# Altium project simple-dash-q23.PrjPcb
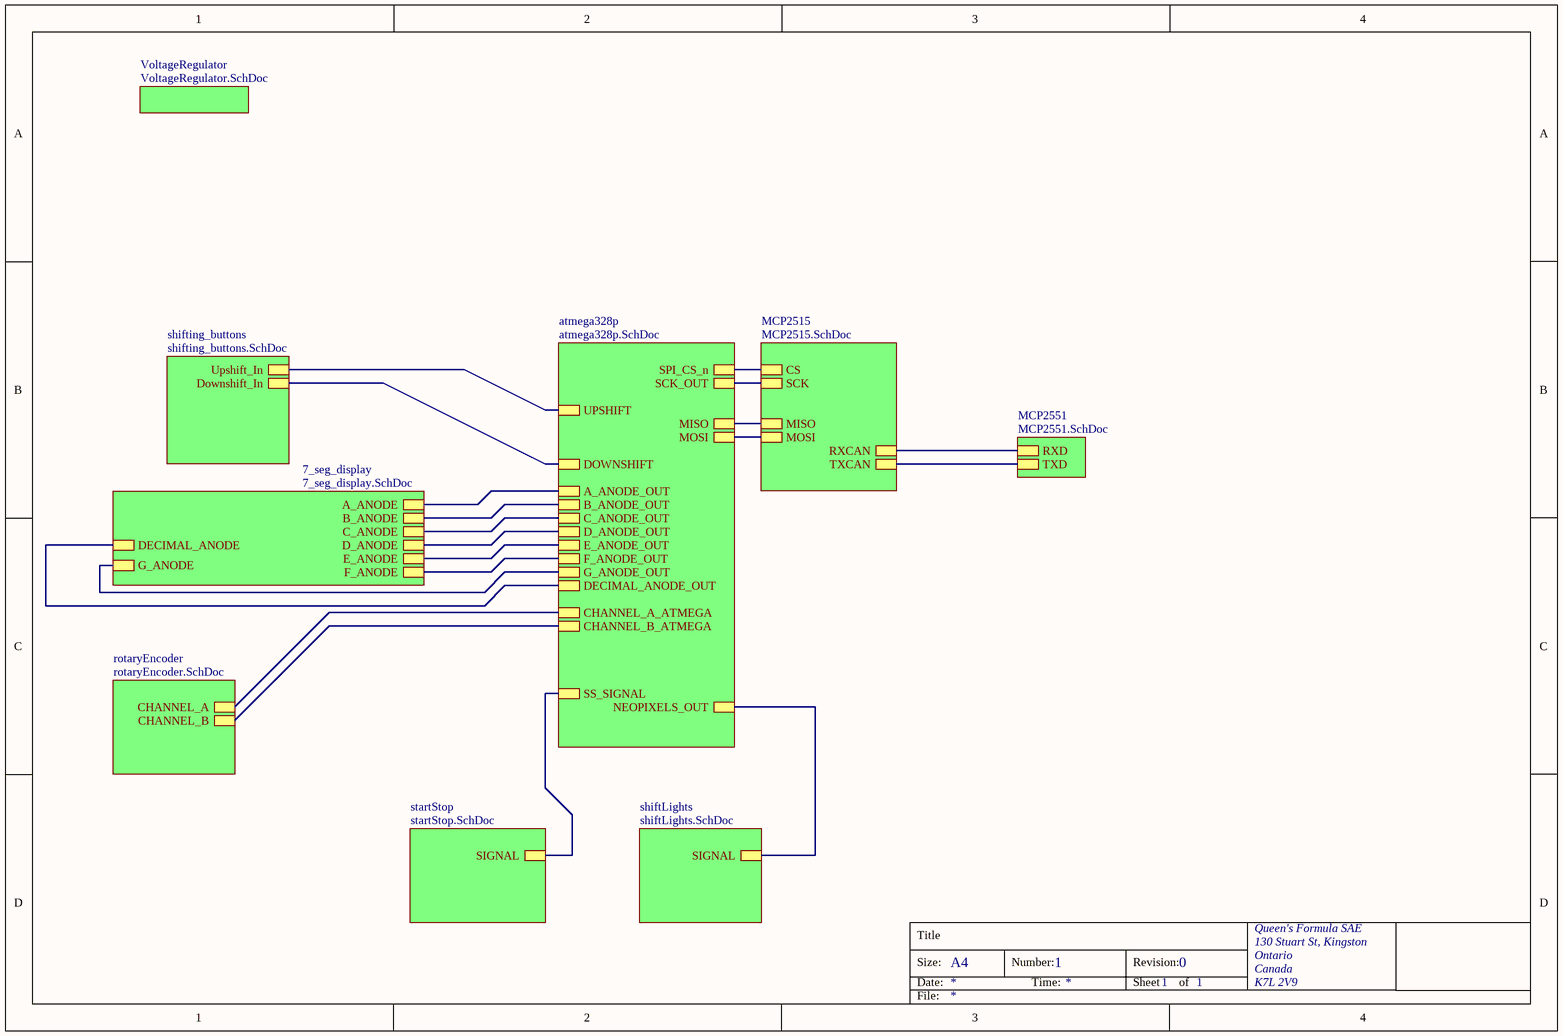
[diagram p0: TOP.SchDoc]
10 sheets, 60 parts. Net scope: hierarchical (ports join the sheet entries above them; power ports are global).
Board files: PCB.PcbDoc, VoltageRegulator.PcbDoc
Sheets:
  TOP.SchDoc
    VoltageRegulator = VoltageRegulator.SchDoc
    atmega328p = atmega328p.SchDoc
    MCP2515 = MCP2515.SchDoc
    MCP2551 = MCP2551.SchDoc
    shifting_buttons = shifting_buttons.SchDoc
    7_seg_display = 7_seg_display.SchDoc
    rotaryEncoder = rotaryEncoder.SchDoc
    startStop = startStop.SchDoc
    shiftLights = shiftLights.SchDoc

## Sheet TOP.SchDoc: =DocumentName
size A4; Organization: Queen's Formula SAE; Address1: 130 Stuart St, Kingston; Address2: Ontario; Address3: Canada; Address4: K7L 2V9; DocumentNumber: 1; Revision: 0; SheetNumber: 1; SheetTotal: 1

### Sub-sheets
7_seg_display = 7_seg_display.SchDoc: A_ANODE, B_ANODE, C_ANODE, D_ANODE, E_ANODE, F_ANODE, G_ANODE, DECIMAL_ANODE
atmega328p = atmega328p.SchDoc: SPI_CS_n, UPSHIFT, MOSI, MISO, SCK_OUT, DOWNSHIFT, CHANNEL_A_ATMEGA, CHANNEL_B_ATMEGA, NEOPIXELS_OUT, A_ANODE_OUT, B_ANODE_OUT, C_ANODE_OUT, D_ANODE_OUT, E_ANODE_OUT, F_ANODE_OUT, G_ANODE_OUT, DECIMAL_ANODE_OUT, SS_SIGNAL
MCP2515 = MCP2515.SchDoc: MOSI, MISO, CS, SCK, TXCAN, RXCAN
MCP2551 = MCP2551.SchDoc: RXD, TXD
rotaryEncoder = rotaryEncoder.SchDoc: CHANNEL_A, CHANNEL_B
shifting_buttons = shifting_buttons.SchDoc: Upshift_In, Downshift_In
shiftLights = shiftLights.SchDoc: SIGNAL
startStop = startStop.SchDoc: SIGNAL
VoltageRegulator = VoltageRegulator.SchDoc: no entries

### Nets
A_ANODE_OUT: sheet atmega328p/A_ANODE_OUT, sheet 7_seg_display/A_ANODE
B_ANODE_OUT: sheet atmega328p/B_ANODE_OUT, sheet 7_seg_display/B_ANODE
C_ANODE_OUT: sheet atmega328p/C_ANODE_OUT, sheet 7_seg_display/C_ANODE
D_ANODE_OUT: sheet atmega328p/D_ANODE_OUT, sheet 7_seg_display/D_ANODE
DA_OUT: sheet atmega328p/DECIMAL_ANODE_OUT, sheet 7_seg_display/DECIMAL_ANODE
DOWNSHIFT: sheet atmega328p/DOWNSHIFT, sheet shifting_buttons/Downshift_In
E_ANODE_OUT: sheet atmega328p/E_ANODE_OUT, sheet 7_seg_display/E_ANODE
F_ANODE_OUT: sheet atmega328p/F_ANODE_OUT, sheet 7_seg_display/F_ANODE
G_ANODE_OUT: sheet atmega328p/G_ANODE_OUT, sheet 7_seg_display/G_ANODE
MISO: sheet atmega328p/MOSI, sheet atmega328p/MISO, sheet atmega328p/SCK_OUT, sheet MCP2515/MOSI, sheet MCP2515/MISO, sheet MCP2515/SCK
NEOPIXELS_OUT: sheet atmega328p/NEOPIXELS_OUT, sheet shiftLights/SIGNAL
SPI_CS_n: sheet atmega328p/SPI_CS_n, sheet MCP2515/CS
UPSHIFT: sheet atmega328p/UPSHIFT, sheet shifting_buttons/Upshift_In
NetENC1_A: sheet atmega328p/CHANNEL_A_ATMEGA, sheet rotaryEncoder/CHANNEL_A
NetENC1_B: sheet atmega328p/CHANNEL_B_ATMEGA, sheet rotaryEncoder/CHANNEL_B
NetP12_1: sheet atmega328p/SS_SIGNAL, sheet startStop/SIGNAL
NetU3_1: sheet MCP2515/TXCAN, sheet MCP2551/TXD
NetU3_2: sheet MCP2515/RXCAN, sheet MCP2551/RXD

### Notes on the sheet
- Title
- Size:
- Date:
- A4
- Number:
- Time:
- Revision:
- Sheet
- of
- File:

## Sheet VoltageRegulator.SchDoc
size A4; SPICEModelCacheXNGDLXAO: <root> / <DocumentId>XNGDLXAO</DocumentId> / <CacheFrame Number="0"> / <Model Name="led1" Kind="MDL"> / <Text>*Typ RED GaAs LED: Vf=1.7V Vr=4V If=40mA trr=3uS / *LED Pinout: 1=A, 2=K / .MODEL LED1 D (IS=93.2P RS=42M N=3.73 BV=4 IBV=10U / + CJO=2.97P VJ=.75 M=.333 TT=4.32U)</Text> / </Model> / </CacheFrame> / </root>
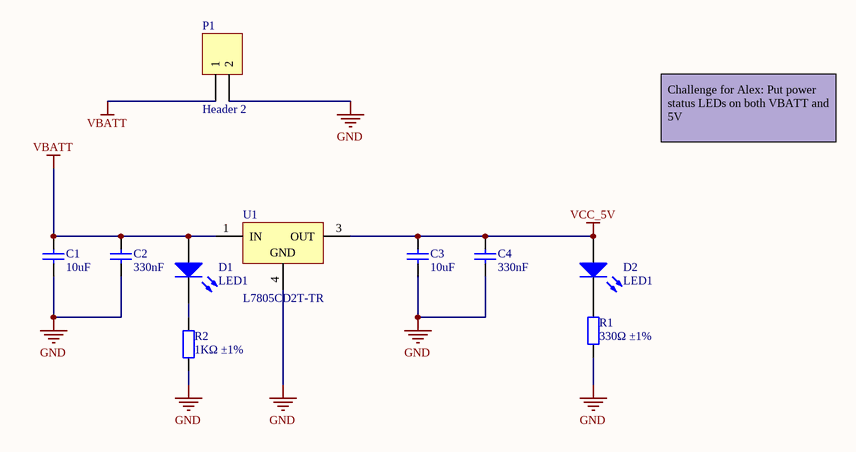
[diagram p1: VoltageRegulator.SchDoc]

### Parts
C1  10uF  [1206_C]
C2  330nF  [0603_C]
C3  10uF  [1206_C]
C4  330nF  [0603_C]
D1  LED1  [LED-1]
D2  LED1  [LED-1]
P1  Header 2  [HDR1X2]
R1  330Ω ±1%  [0603_R]
R2  1KΩ ±1%  [0805_R]
U1  L7805CD2T-TR  [TO-263_M]

### Nets
GND: C1.1 C2.1 C3.1 C4.1 P1.2 R1.2 R2.1 U1.4(GND)
VBATT: C1.2 C2.2 D1.1(A) P1.1 U1.1(IN)
VCC_5V: C3.2 C4.2 D2.1(A) U1.3(OUT)
NetD1_2: D1.2(K) R2.2
NetD2_2: D2.2(K) R1.1

### Notes on the sheet
- Challenge for Alex: Put power status LEDs on both VBATT and 5V

### Library data of the parts
C1 C3 = 1206 10uF (106) 10% 50V: Chip capacitors; Manufacturer: Samsung Electro-Mechanics; PartNumber: CL31A106KBHNNNE; Tolerance: 10%; Voltage: 50V; ComponentLink1Description: Supplier link; ComponentLink1URL: http://www.szlcsc.com/product/details_14236.html; Package: 1206; Supplier: LC; SuppliersPartNumber: C13585; Capacitance: 10uF
C2 C4 = 0603 330nF (334) 10% 25V: Chip capacitors; Manufacturer: Guangdong Fenghua Advanced Tech; PartNumber: 0603B334K250NT; Tolerance: 10%; Voltage: 25V; ComponentLink1Description: Supplier link; ComponentLink1URL: http://www.szlcsc.com/product/details_1967.html; Package: 0603; Supplier: LC; SuppliersPartNumber: C1615; Capacitance: 330nF
D1 D2 = LED1: Typical RED GaAs LED; Published: 8-Jun-2000; LatestRevisionDate: 08-Jul-2005; LatestRevisionNote: Mech Layer 1 removed.; PackageReference: LED-1; Publisher: Altium Limited; PackageDescription: LED; 2 Leads
P1 = Header 2: Header, 2-Pin; LatestRevisionDate: 17-Jul-2002; LatestRevisionNote: Re-released for DXP Platform.; Publisher: Altium Limited
R1 = 0603 330R (3300) 1%: Chip resistor; Manufacturer: Uniroyal Elec; PartNumber: 0603WAF3300T5E; Power: 1/10W; ComponentLink1Description: Supplier link; ComponentLink1URL: http://www.szlcsc.com/product/details_23865.html; Package: 0603; Supplier: LC; SuppliersPartNumber: C23138; Resistance: 330Ω; Tolerance: 1%
R2 = 0805 1K (1001) 1%: Chip resistor; Manufacturer: Uniroyal Elec; Power: 1/8W; ComponentLink1Description: Supplier link; ComponentLink1URL: http://www.szlcsc.com/product/details_18201.html; Package: 0805; Supplier: LC; SuppliersPartNumber: C17513; Tolerance: 1%
U1 = CMP-0244-00213-1: Positive Voltage Regulator, 3-Pin D2PAK, Tape and Reel; PackageReference: TO-263; ComponentLink2URL: http://www.st.com/internet/com/TECHNICAL_RESOURCES/TECHNICAL_LITERATURE/DATASHEET/CD00000444.pdf; PackageDescription: 3-Pin Transistor Outline Package 2.54 mm Pitch, 15.4 mm Lead Span (D2PAK); DatasheetVersion: 16/11/2011; ComponentLink2Description: Datasheet; ComponentLink1Description: Manufacturer URL; PackageVersion: 2011; ComponentLink1URL: http://www.st.com

## Sheet atmega328p.SchDoc
size A4
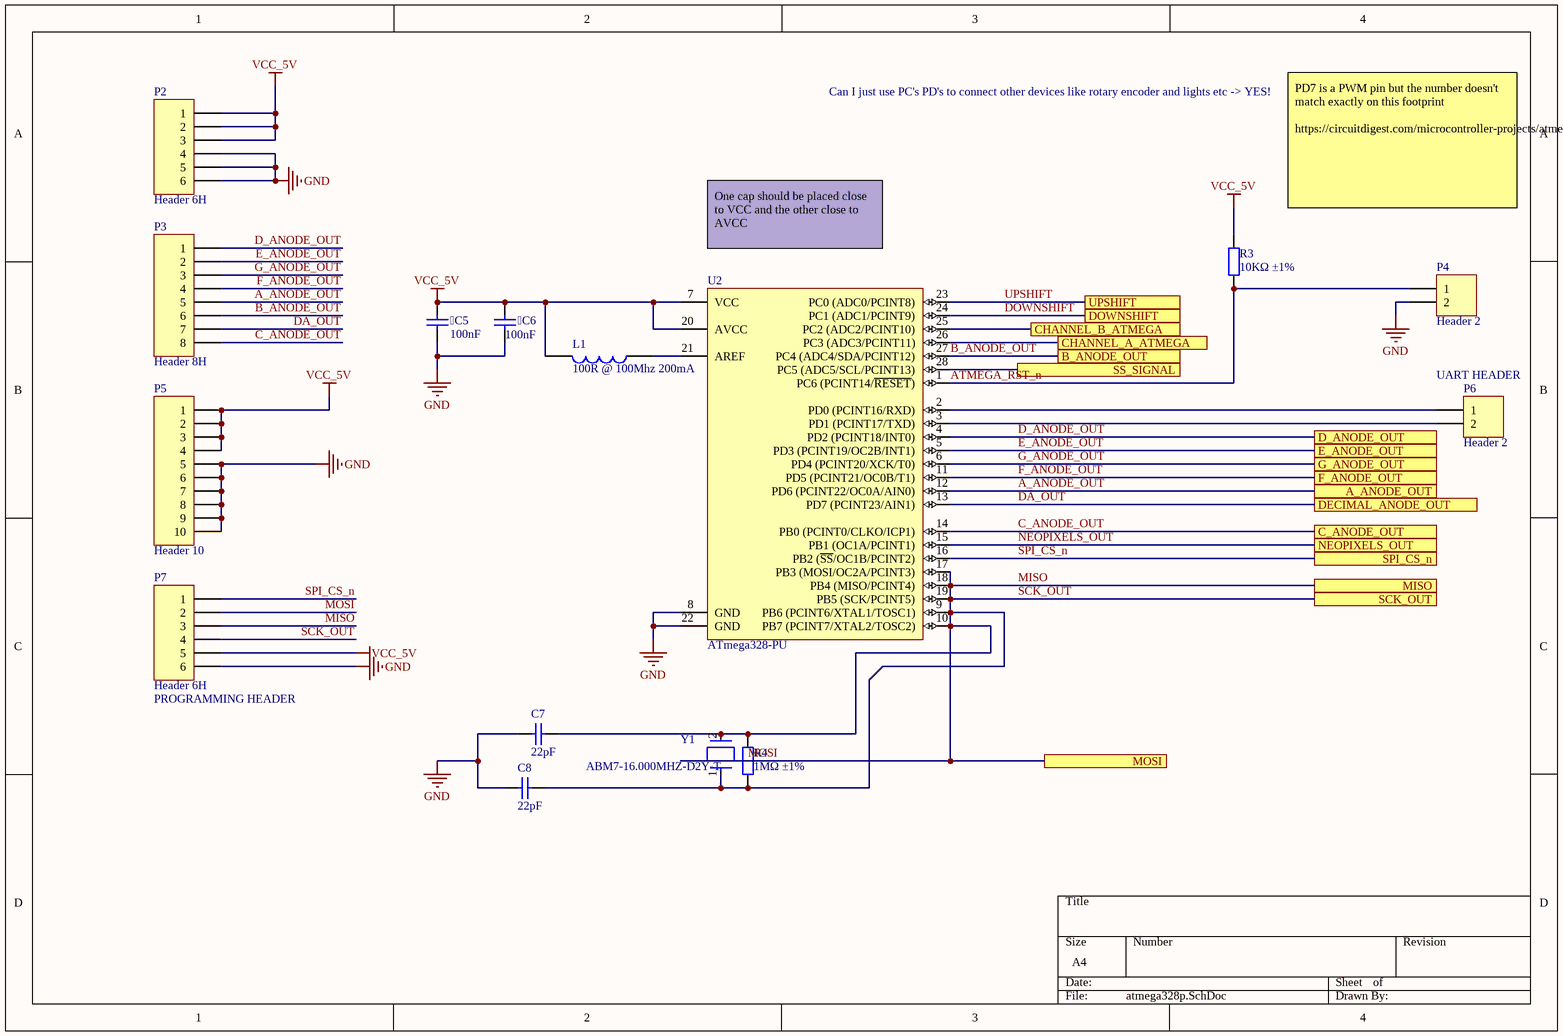
[diagram p2: atmega328p.SchDoc]

### Parts
C5  100nF  [0603_C]
C6  100nF  [0603_C]
C7  22pF  [0603_C]
C8  22pF  [0603_C]
L1  100R @ 100Mhz 200mA  [0603_L]
P2  Header 6H  [HDR1X6H]
P3  Header 8H  [HDR1X8H]
P4  Header 2  [HDR1X2]
P5  Header 10  [HDR1X10]
P6  Header 2  [HDR1X2]
P7  Header 6H  [HDR1X6H]
R3  10KΩ ±1%  [0603_R]
R4  1MΩ ±1%  [0603_R]
U2  ATmega328-PU  [28P3]
Y1  ABM7-16.000MHZ-D2Y-T  [FP-ABM7-MFG]

### Ports
A_ANODE_OUT, B_ANODE_OUT, C_ANODE_OUT, CHANNEL_A_ATMEGA, CHANNEL_B_ATMEGA, D_ANODE_OUT, DECIMAL_ANODE_OUT, DOWNSHIFT, E_ANODE_OUT, F_ANODE_OUT, G_ANODE_OUT, MISO, MOSI, NEOPIXELS_OUT, SCK_OUT, SPI_CS_n, SS_SIGNAL, UPSHIFT

### Nets
GND: C5.1 C6.1 C7.1 C8.1 P2.4 P2.5 P2.6 P4.2 P5.5 P5.6 P5.7 P5.8 P5.9 P5.10 P7.6 U2.8(GND) U2.22(GND)
VCC_5V: C5.2 C6.2 L1.2 P2.1 P2.2 P2.3 P5.1 P5.2 P5.3 P5.4 P7.5 R3.2 U2.7(VCC) U2.20(AVCC)
A_ANODE_OUT: P3.5 U2.12(PD6_(PCINT22/OC0A/AIN0)) ; port A_ANODE_OUT
ATMEGA_RST_n: P4.1 R3.1 U2.1(PC6_(PCINT14/~{RESET}))
B_ANODE_OUT: P3.6 U2.27(PC4_(ADC4/SDA/PCINT12)) ; port B_ANODE_OUT
C_ANODE_OUT: P3.8 U2.14(PB0_(PCINT0/CLKO/ICP1)) ; port C_ANODE_OUT
D_ANODE_OUT: P3.1 U2.4(PD2_(PCINT18/INT0)) ; port D_ANODE_OUT
DA_OUT: P3.7 U2.13(PD7_(PCINT23/AIN1)) ; port DECIMAL_ANODE_OUT
DOWNSHIFT: U2.24(PC1_(ADC1/PCINT9)) ; port DOWNSHIFT
E_ANODE_OUT: P3.2 U2.5(PD3_(PCINT19/OC2B/INT1)) ; port E_ANODE_OUT
F_ANODE_OUT: P3.4 U2.11(PD5_(PCINT21/OC0B/T1)) ; port F_ANODE_OUT
G_ANODE_OUT: P3.3 U2.6(PD4_(PCINT20/XCK/T0)) ; port G_ANODE_OUT
MISO: C7.2 C8.2 P7.2 P7.3 P7.4 R4.1 R4.2 U2.9(PB6_(PCINT6/XTAL1/TOSC1)) U2.10(PB7_(PCINT7/XTAL2/TOSC2)) U2.17(PB3_(MOSI/OC2A/PCINT3)) U2.18(PB4_(MISO/PCINT4)) U2.19(PB5_(SCK/PCINT5)) Y1.1 Y1.2 ; port MISO, port MOSI, port SCK_OUT  [also labelled MOSI, SCK_OUT]
NEOPIXELS_OUT: U2.15(PB1_(OC1A/PCINT1)) ; port NEOPIXELS_OUT
SPI_CS_n: P7.1 U2.16(PB2_(~{SS}/OC1B/PCINT2)) ; port SPI_CS_n
UPSHIFT: U2.23(PC0_(ADC0/PCINT8)) ; port UPSHIFT
NetENC1_A: U2.26(PC3_(ADC3/PCINT11)) ; port CHANNEL_A_ATMEGA
NetENC1_B: U2.25(PC2_(ADC2/PCINT10)) ; port CHANNEL_B_ATMEGA
NetL1_1: L1.1 U2.21(AREF)
NetP6_1: P6.1 U2.2(PD0_(PCINT16/RXD))
NetP6_2: P6.2 U2.3(PD1_(PCINT17/TXD))
NetP12_1: U2.28(PC5_(ADC5/SCL/PCINT13)) ; port SS_SIGNAL

### Notes on the sheet
- Can I just use PC's PD's to connect other devices like rotary encoder and lights etc -> YES!
- One cap should be placed close to VCC and the other close to AVCC
- PD7 is a PWM pin but the number doesn't match exactly on this footprint
  https://circuitdigest.com/microcontroller-projects/atmega16-32-microcontroller-pwm-tutorial-to-control-brightness-of-led
- (near P6) UART HEADER
- (near P7) PROGRAMMING HEADER

### Library data of the parts
C5 C6 = 0603 100nF (104) 10% 50V: Chip capacitors; Manufacturer: YAGEO; PartNumber: CC0603KRX7R9BB104; Tolerance: 10%; Voltage: 50V; ComponentLink1Description: Supplier link; ComponentLink1URL: http://www.szlcsc.com/product/details_15331.html; Package: 0603; Supplier: LC; SuppliersPartNumber: C14663; Capacitance: 100nF
C7 C8 = 0603 22pF (220) 5% 50V: Chip capacitors; Manufacturer: Samsung Electro-Mechanics; PartNumber: CL10C220JB8NNNC; Tolerance: 5%; Voltage: 50V; ComponentLink1Description: Supplier link; ComponentLink1URL: http://www.szlcsc.com/product/details_2005.html; Package: 0603; Supplier: LC; SuppliersPartNumber: C1653; Capacitance: 22pF
L1 = 0603 100R@100Mhz 0.2A: Ferrite Bead; Notepad: *; Package: 0603; Supplier: LC; SuppliersPartNumber: C98498
P2 P7 = Header 6H: Header, 6-Pin, Right Angle; LatestRevisionDate: 17-Jul-2002; LatestRevisionNote: Re-released for DXP Platform.; Publisher: Altium Limited
P3 = Header 8H: Header, 8-Pin, Right Angle; LatestRevisionDate: 17-Jul-2002; LatestRevisionNote: Re-released for DXP Platform.; Publisher: Altium Limited
P4 P6 = Header 2: Header, 2-Pin; LatestRevisionDate: 17-Jul-2002; LatestRevisionNote: Re-released for DXP Platform.; Publisher: Altium Limited
P5 = Header 10: Header, 10-Pin; LatestRevisionDate: 17-Jul-2002; LatestRevisionNote: Re-released for DXP Platform.; Publisher: Altium Limited
R3 = 0603 10K (1002) 1%: Chip resistor; Manufacturer: Uniroyal Elec; PartNumber: 0603WAF1002T5E; Power: 1/10W; ComponentLink1Description: Supplier link; ComponentLink1URL: http://www.szlcsc.com/product/details_26547.html; Package: 0603; Supplier: LC; SuppliersPartNumber: C25804; Resistance: 10KΩ; Tolerance: 1%
R4 = 0603 1M (1004) 1%: Chip resistor; Manufacturer: Uniroyal Elec; PartNumber: 0603WAF1004T5E; Power: 1/10W; ComponentLink1Description: Supplier link; ComponentLink1URL: http://www.szlcsc.com/product/details_23662.html; Package: 0603; Supplier: LC; SuppliersPartNumber: C22935; Resistance: 1MΩ; Tolerance: 1%
U2 = CMP-0095-00015-2: 8-bit AVR Microcontroller, 32KB Flash, 1KB EEPROM, 2KB SRAM, 28-pin PDIP, Industrial Grade (-40°C to 85°C); ComponentLink3Description: ATmega48A/48PA/88A/88PA/168A/168PA/328/328P Summary; RevisionNote: DatasheetVersion updated. URLs added.; DatasheetVersion: revD, May-2011; ComponentLink1URL: http://www.atmel.com/; PackageVersion: revB, Sep-2001; PackageDescription: 28-lead (0.300"/7.62mm Wide) Plastic Dual Inline Package (PDIP); PackageReference: 28P3; ComponentLink1Description: Manufacturer URL; ComponentLink2Description: ATmega48A/48PA/88A/88PA/168A/168PA/328/328P Datasheet; ComponentLink3URL: http://www.atmel.com/dyn/resources/prod_documents/8271S.pdf; ComponentLink2URL: http://www.atmel.com/dyn/resources/prod_documents/8271.pdf
Y1 = CMP-27762-000095-1: Crystal 16MHz ±20ppm 18pF SMD-2 6mm x 3.5mm; ESR (Equivalent Series Resistance): 50R; Frequency Stability: 30ppm; Width: 3.3mm; Frequency: 16MHz; Radiation Hardening: No; Height: 0.055inch; Tolerance: 20ppm; Length: 6mm; Case/Package: CSMD; Lead Free: Lead Free; Min Operating Temperature: -40°C; Termination: SMD/SMT; Operating Frequency: 16 MHz; Resistor Type: Ceramic; Packaging: Tape and Reel; Mount: Surface Mount; Load Capacitance: 18pF; Frequency Tolerance: 20ppm; Depth: 3.5mm; Series: ABM7; Package Quantity: 1000; Max Operating Temperature: 85°C; Number of Pins: 2

## Sheet MCP2515.SchDoc
size A4
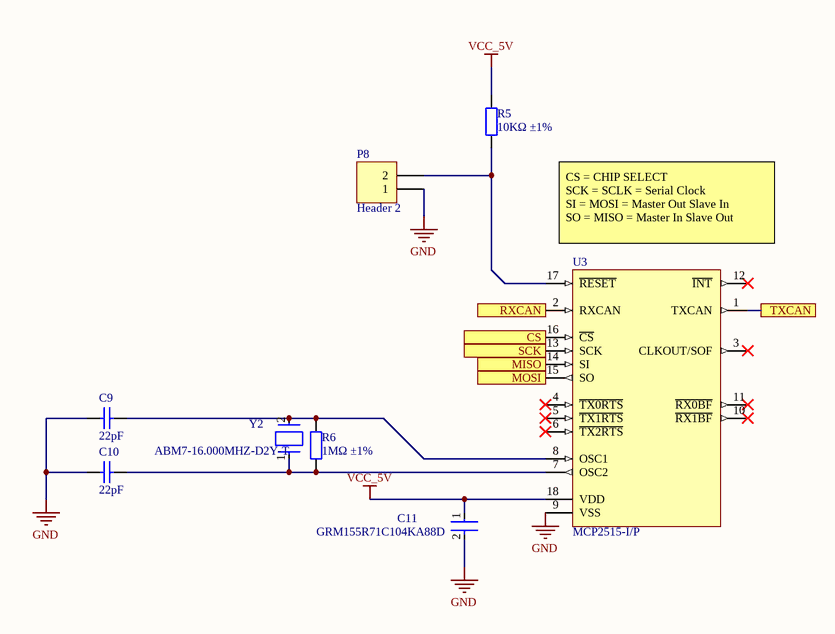
[diagram p3: MCP2515.SchDoc]

### Parts
C9  22pF  [0603_C]
C10  22pF  [0603_C]
C11  GRM155R71C104KA88D  [FP-GRM15-MFG]
P8  Header 2  [HDR1X2]
R5  10KΩ ±1%  [0603_R]
R6  1MΩ ±1%  [0603_R]
U3  MCP2515-I/P  [PDIP300-P18]
Y2  ABM7-16.000MHZ-D2Y-T  [FP-ABM7-MFG]

### Ports
CS, MISO, MOSI, RXCAN, SCK, TXCAN

### Nets
GND: C9.1 C10.1 C11.2 P8.1 U3.9(VSS)
VCC_5V: C11.1 R5.2 U3.18(VDD)
MISO: U3.13(SCK) U3.14(SI) U3.15(SO) ; port SCK, port MISO, port MOSI
SPI_CS_n: U3.16(~{CS}) ; port CS
NetC9_2: C9.2 R6.2 U3.8(OSC1) Y2.2
NetC10_2: C10.2 R6.1 U3.7(OSC2) Y2.1
NetP8_2: P8.2 R5.1 U3.17(~{RESET})
NetU3_1: U3.1(TXCAN) ; port TXCAN
NetU3_2: U3.2(RXCAN) ; port RXCAN

Not connected (* = marked no-connect by the designer): U3 3(CLKOUT/SOF)* 4(~{TX0RTS})* 5(~{TX1RTS})* 6(~{TX2RTS})* 10(~{RX1BF})* 11(~{RX0BF})* 12(~{INT})*

### Notes on the sheet
- (near U3) CS = CHIP SELECT
  SCK = SCLK = Serial Clock
  SI = MOSI = Master Out Slave In
  SO = MISO = Master In Slave Out

### Library data of the parts
C9 C10 = 0603 22pF (220) 5% 50V: as C7 on sheet atmega328p; ComponentLink1Description: Supplier link; ComponentLink1URL: http://www.szlcsc.com/product/details_2005.html; Package: 0603; Supplier: LC; SuppliersPartNumber: C1653; Capacitance: 22pF
C11 = CMP-2100-03641-2: CAP CER 0.1UF 16V X7R 0402; Manufacturer: Murata; Standoff Height: 0mm; Tolerance: 10%; Voltage Rating: 16Vdc; Material: Ceramic; Capacitance: 0.10μF; Value: 0.10μF; RoHS: TRUE; Manufacturer Part Number: GRM155R71C104KA88D; Temperature Characteristic: X7R; Octopart: https://octopart.com/grm155r71c104ka88d-murata-196880; Digikey Description: CAP CER 0.1UF 16V X7R 0402; Device Class L3: Ceramic Capacitors; Height: 0.55mm; ComponentLink2Description: Datasheet; Temperature Range Low: -55°C; Ipc Land Pattern Name: CAPC10050X219; ComponentLink2URL: https://search.murata.co.jp/Ceramy/image/img/A01X/G101/ENG/GRM155R71H471KA01-01A.pdf; Device Class L1: Passive Components; Lead Free: yes; Category: Cap; Package: GRM15; Temperature: -55°C to +125°C; Device Class L2: Capacitors; Temperature Range High: +125°C; Mouser Description: 0402 0.1 uF 16V ±10 % Tolerance X7R SMT Multilayer Ceramic Capacitor
P8 = Header 2: Header, 2-Pin; LatestRevisionDate: 17-Jul-2002; LatestRevisionNote: Re-released for DXP Platform.; Publisher: Altium Limited
R5 = 0603 10K (1002) 1%: as R3 on sheet atmega328p; ComponentLink1Description: Supplier link; ComponentLink1URL: http://www.szlcsc.com/product/details_26547.html; Package: 0603; Supplier: LC; SuppliersPartNumber: C25804; Resistance: 10KΩ; Tolerance: 1%
R6 = 0603 1M (1004) 1%: as R4 on sheet atmega328p; ComponentLink1Description: Supplier link; ComponentLink1URL: http://www.szlcsc.com/product/details_23662.html; Package: 0603; Supplier: LC; SuppliersPartNumber: C22935; Resistance: 1MΩ; Tolerance: 1%
U3 = CMP-0186-00010-2: Stand-Alone CAN Controller With SPI Interface, 18-Pin PDIP, Industrial Temperature; PackageReference: PDIP300-P18; ComponentLink3Description: Package Specification; PackageVersion: revBB, Aug-2009; ComponentLink2URL: http://ww1.microchip.com/downloads/en/DeviceDoc/21801f.pdf; RevisionNote: URLs added. DatasheetVersion updated.; Code_JEDEC: MS-001; PackageDescription: 18-Lead Plastic Dual In-Line (P) - 300 mil Body [PDIP]; ComponentLink1Description: Manufacturer URL; ComponentLink1URL: http://www.microchip.com/; DatasheetVersion: revF, Oct-2010; ComponentLink2Description: Datasheet; ComponentLink3URL: http://www.microchip.com/stellent/groups/techpub_sg/documents/packagingspec/en012702.pdf
Y2 = CMP-27762-000095-1: as Y1 on sheet atmega328p; Width: 3.3mm; Frequency: 16MHz; Radiation Hardening: No; Height: 0.055inch; Tolerance: 20ppm; Length: 6mm; Case/Package: CSMD; Lead Free: Lead Free; Min Operating Temperature: -40°C; Termination: SMD/SMT; Operating Frequency: 16 MHz; Resistor Type: Ceramic; Packaging: Tape and Reel; Mount: Surface Mount; Load Capacitance: 18pF; Frequency Tolerance: 20ppm; Depth: 3.5mm; Series: ABM7; Package Quantity: 1000; Max Operating Temperature: 85°C; Number of Pins: 2

## Sheet MCP2551.SchDoc
size A4
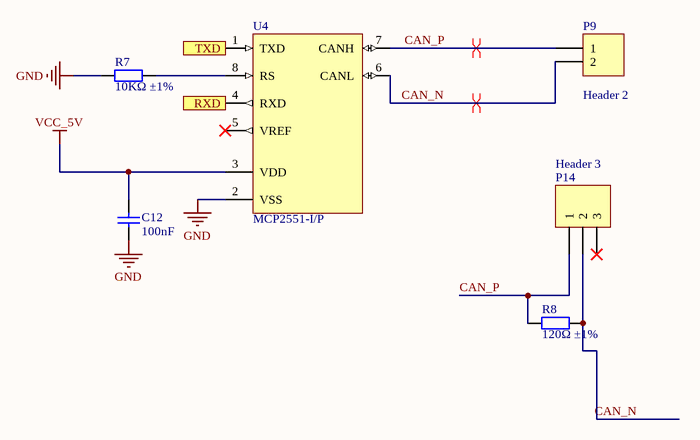
[diagram p4: MCP2551.SchDoc]

### Parts
C12  100nF  [0603_C]
P9  Header 2  [HDR1X2]
P14  Header 3  [HDR1X3]
R7  10KΩ ±1%  [0805_R]
R8  120Ω ±1%  [0603_R]
U4  MCP2551-I/P  [PDIP300-P8]

### Ports
RXD, TXD

### Nets
GND: C12.1 R7.2 U4.2(VSS)
VCC_5V: C12.2 U4.3(VDD)
CAN_N: P9.2 P14.2 R8.1 U4.6(CANL)
CAN_P: P9.1 P14.1 R8.2 U4.7(CANH)
NetR7_1: R7.1 U4.8(RS)
NetU3_1: U4.1(TXD) ; port TXD
NetU3_2: U4.4(RXD) ; port RXD

Not connected (* = marked no-connect by the designer): P14 3*; U4 5(VREF)*

### Layout directives
differential pair: CAN_N, CAN_P

### Library data of the parts
C12 = 0603 100nF (104) 10% 50V: as C5 on sheet atmega328p; ComponentLink1Description: Supplier link; ComponentLink1URL: http://www.szlcsc.com/product/details_15331.html; Package: 0603; Supplier: LC; SuppliersPartNumber: C14663; Capacitance: 100nF
P9 = Header 2: Header, 2-Pin; LatestRevisionDate: 17-Jul-2002; LatestRevisionNote: Re-released for DXP Platform.; Publisher: Altium Limited
P14 = Header 3: Header, 3-Pin; LatestRevisionDate: 17-Jul-2002; LatestRevisionNote: Re-released for DXP Platform.; Publisher: Altium Limited
R7 = 0805 10K (1002) 1%: Chip resistor; Manufacturer: Uniroyal Elec; PartNumber: 0805W8F1002T5E; Power: 1/8W; ComponentLink1Description: Supplier link; ComponentLink1URL: http://www.szlcsc.com/product/details_18102.html; Package: 0805; Supplier: LC; SuppliersPartNumber: C17414; Resistance: 10KΩ; Tolerance: 1%
R8 = 0603 120R (1200) 1%: Chip resistor; Manufacturer: Uniroyal Elec; PartNumber: 0603WAF1200T5E; Power: 1/10W; ComponentLink1Description: Supplier link; ComponentLink1URL: http://www.szlcsc.com/product/details_23514.html; Package: 0603; Supplier: LC; SuppliersPartNumber: C22787; Resistance: 120Ω; Tolerance: 1%
U4 = CMP-0186-00101-2: High-Speed CAN Transceiver, 8-Pin PDIP, Industrial Temperature; PackageDescription: 8-Lead Plastic Dual In-Line (P) - 300 mil Body [PDIP]; Code_JEDEC: MS-001; ComponentLink1Description: Manufacturer URL; DatasheetVersion: revF, Jul-2010; PackageReference: PDIP300-P8; ComponentLink3Description: Package Specification; ComponentLink3URL: http://www.microchip.com/stellent/groups/techpub_sg/documents/packagingspec/en012702.pdf; ComponentLink2URL: http://ww1.microchip.com/downloads/en/DeviceDoc/21667F.pdf; ComponentLink1URL: http://www.microchip.com/; RevisionNote: URLs added. DatasheetVersion updated.; PackageVersion: revBB, Aug-2009; ComponentLink2Description: Datasheet

## Sheet shifting_buttons.SchDoc
size A4
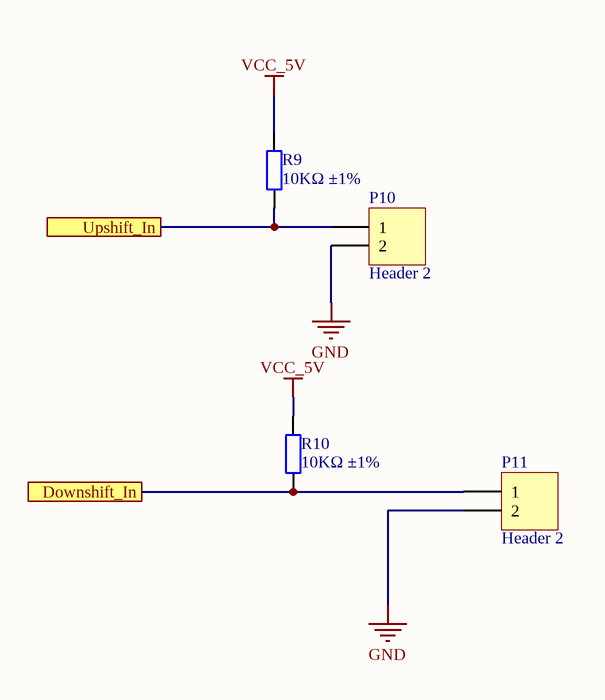
[diagram p5: shifting_buttons.SchDoc]

### Parts
P10  Header 2  [HDR1X2]
P11  Header 2  [HDR1X2]
R9  10KΩ ±1%  [0603_R]
R10  10KΩ ±1%  [0603_R]

### Ports
Downshift_In, Upshift_In

### Nets
GND: P10.2 P11.2
VCC_5V: R9.2 R10.2
DOWNSHIFT: P11.1 R10.1 ; port Downshift_In
UPSHIFT: P10.1 R9.1 ; port Upshift_In

### Library data of the parts
P10 P11 = Header 2: Header, 2-Pin; LatestRevisionDate: 17-Jul-2002; LatestRevisionNote: Re-released for DXP Platform.; Publisher: Altium Limited
R9 R10 = 0603 10K (1002) 1%: as R3 on sheet atmega328p; ComponentLink1Description: Supplier link; ComponentLink1URL: http://www.szlcsc.com/product/details_26547.html; Package: 0603; Supplier: LC; SuppliersPartNumber: C25804; Resistance: 10KΩ; Tolerance: 1%

## Sheet 7_seg_display.SchDoc
size A4
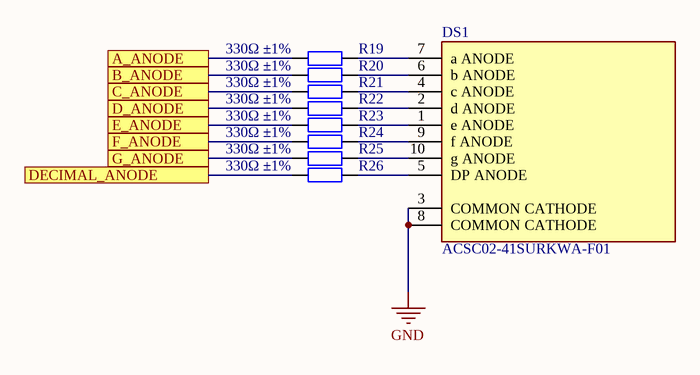
[diagram p6: 7_seg_display.SchDoc]

### Parts
DS1  ACSC02-41SURKWA-F01  [FP-ACSC02-41SURKWA-F01-MFG]
R19  330Ω ±1%  [0603_R]
R20  330Ω ±1%  [0603_R]
R21  330Ω ±1%  [0603_R]
R22  330Ω ±1%  [0603_R]
R23  330Ω ±1%  [0603_R]
R24  330Ω ±1%  [0603_R]
R25  330Ω ±1%  [0603_R]
R26  330Ω ±1%  [0603_R]

### Ports
A_ANODE, B_ANODE, C_ANODE, D_ANODE, DECIMAL_ANODE, E_ANODE, F_ANODE, G_ANODE

### Nets
GND: DS1.3(COMMON_CATHODE) DS1.8(COMMON_CATHODE)
A_ANODE_OUT: R19.2 ; port A_ANODE
B_ANODE_OUT: R20.2 ; port B_ANODE
C_ANODE_OUT: R21.2 ; port C_ANODE
D_ANODE_OUT: R22.2 ; port D_ANODE
DA_OUT: R26.2 ; port DECIMAL_ANODE
E_ANODE_OUT: R23.2 ; port E_ANODE
F_ANODE_OUT: R24.2 ; port F_ANODE
G_ANODE_OUT: R25.2 ; port G_ANODE
NetDS1_1: DS1.1(e_ANODE) R23.1
NetDS1_2: DS1.2(d_ANODE) R22.1
NetDS1_4: DS1.4(c_ANODE) R21.1
NetDS1_5: DS1.5(DP_ANODE) R26.1
NetDS1_6: DS1.6(b_ANODE) R20.1
NetDS1_7: DS1.7(a_ANODE) R19.1
NetDS1_9: DS1.9(f_ANODE) R24.1
NetDS1_10: DS1.10(g_ANODE) R25.1

### Library data of the parts
DS1 = CMP-44525-000002-1: DISPLAY 7-SEG 0.2" SGL RED 10SMD; Element Configuration: Common Cathode; Operating Supply Voltage: 1.95V; Wavelength: 630nm; Power Consumption: 75mW; Number of Characters: 1; Forward Current: 30mA; Test Current: 20mA; Luminous Intensity: 30mcd; Min Operating Temperature: -40°C; Package Quantity: 650; Height: 0.315inch; Packaging: Tape and Reel; Width: 0.272inch; Max Power Dissipation: 75mW; Color: Red; Illumination Color: Red; Lead Free: Lead Free; Case/Package: SMD/SMT; Max Operating Temperature: 85°C; Forward Voltage: 1.95V
R19-R26 = 0603 330R (3300) 1%: as R1 on sheet VoltageRegulator; ComponentLink1Description: Supplier link; ComponentLink1URL: http://www.szlcsc.com/product/details_23865.html; Package: 0603; Supplier: LC; SuppliersPartNumber: C23138; Resistance: 330Ω; Tolerance: 1%

## Sheet rotaryEncoder.SchDoc
size A4
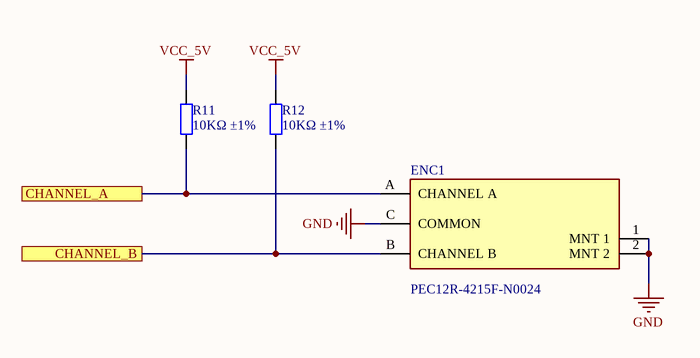
[diagram p7: rotaryEncoder.SchDoc]

### Parts
ENC1  PEC12R-4215F-N0024  [FP-PEC12R-4215F-N0024-MFG]
R11  10KΩ ±1%  [0603_R]
R12  10KΩ ±1%  [0603_R]

### Ports
CHANNEL_A, CHANNEL_B

### Nets
GND: ENC1.1(MNT_1) ENC1.2(MNT_2) ENC1.C(COMMON)
VCC_5V: R11.1 R12.1
NetENC1_A: ENC1.A(CHANNEL_A) R11.2 ; port CHANNEL_A
NetENC1_B: ENC1.B(CHANNEL_B) R12.2 ; port CHANNEL_B

### Library data of the parts
ENC1 = CMP-07421-000052-1: ROTARY ENCODER; RoHS Compliant: Yes; Width: 12.5mm; Length: 13.4mm
R11 R12 = 0603 10K (1002) 1%: as R3 on sheet atmega328p; ComponentLink1Description: Supplier link; ComponentLink1URL: http://www.szlcsc.com/product/details_26547.html; Package: 0603; Supplier: LC; SuppliersPartNumber: C25804; Resistance: 10KΩ; Tolerance: 1%

## Sheet startStop.SchDoc
size A4
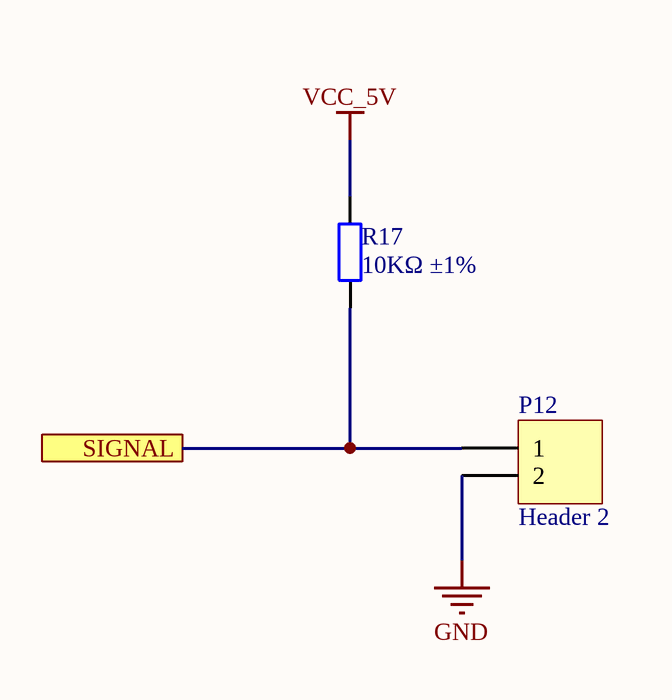
[diagram p8: startStop.SchDoc]

### Parts
P12  Header 2  [HDR1X2]
R17  10KΩ ±1%  [0603_R]

### Ports
SIGNAL

### Nets
GND: P12.2
VCC_5V: R17.2
NetP12_1: P12.1 R17.1 ; port SIGNAL

### Library data of the parts
P12 = Header 2: Header, 2-Pin; LatestRevisionDate: 17-Jul-2002; LatestRevisionNote: Re-released for DXP Platform.; Publisher: Altium Limited
R17 = 0603 10K (1002) 1%: as R3 on sheet atmega328p; ComponentLink1Description: Supplier link; ComponentLink1URL: http://www.szlcsc.com/product/details_26547.html; Package: 0603; Supplier: LC; SuppliersPartNumber: C25804; Resistance: 10KΩ; Tolerance: 1%

## Sheet shiftLights.SchDoc
size A4
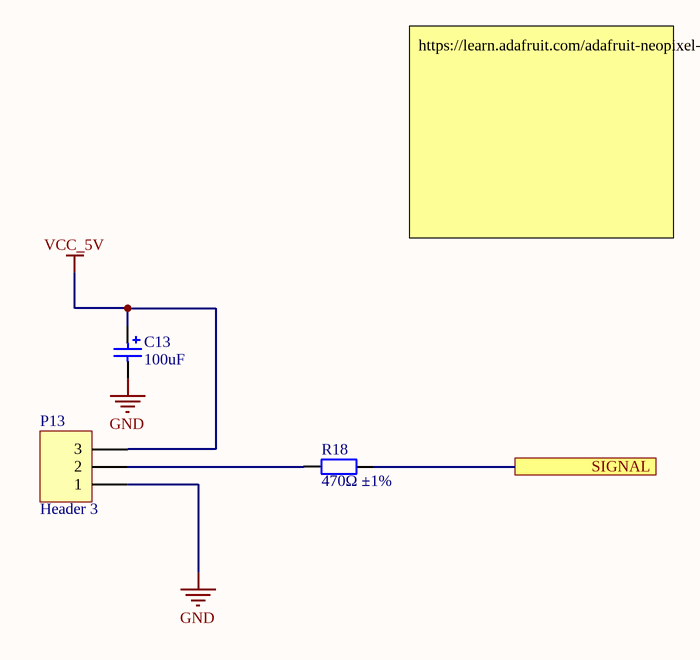
[diagram p9: shiftLights.SchDoc]

### Parts
C13  100uF  [CASE-B_3528]
P13  Header 3  [HDR1X3]
R18  470Ω ±1%  [0603_R]

### Ports
SIGNAL

### Nets
GND: C13.2 P13.1
VCC_5V: C13.1 P13.3
NEOPIXELS_OUT: R18.2 ; port SIGNAL
NetP13_2: P13.2 R18.1

### Notes on the sheet
- https://learn.adafruit.com/adafruit-neopixel-uberguide?view=all

### Library data of the parts
C13 = 3528 100uF (107) 10% 6.3V: Tantalum capacitor; Manufacturer: AVX; PartNumber: TAJB107K006RNJ; Tolerance: 10%; Voltage: 6.3V; ComponentLink1Description: Supplier link; ComponentLink1URL: http://www.szlcsc.com/product/details_16815.html; Package: 3528; Supplier: LC; SuppliersPartNumber: C16133; Capacitance: 100uF
P13 = Header 3: Header, 3-Pin; LatestRevisionDate: 17-Jul-2002; LatestRevisionNote: Re-released for DXP Platform.; Publisher: Altium Limited
R18 = 0603 470R (4700) 1%: Chip resistor; Manufacturer: Uniroyal Elec; PartNumber: 0603WAF4700T5E; Power: 1/10W; ComponentLink1Description: Supplier link; ComponentLink1URL: http://www.szlcsc.com/product/details_23906.html; Package: 0603; Supplier: LC; SuppliersPartNumber: C23179; Resistance: 470Ω; Tolerance: 1%

## Nets that join several sheets
GND: VoltageRegulator (8 pins), atmega328p (17 pins), MCP2515 (5 pins), MCP2551 (C12.1 R7.2 U4.2), shifting_buttons (P10.2 P11.2), 7_seg_display (DS1.3 DS1.8), rotaryEncoder (ENC1.1 ENC1.2 ENC1.C), startStop (P12.2), shiftLights (C13.2 P13.1)
VCC_5V: VoltageRegulator (C3.2 C4.2 D2.1 U1.3), atmega328p (14 pins), MCP2515 (C11.1 R5.2 U3.18), MCP2551 (C12.2 U4.3), shifting_buttons (R9.2 R10.2), rotaryEncoder (R11.1 R12.1), startStop (R17.2), shiftLights (C13.1 P13.3)
A_ANODE_OUT: atmega328p (P3.5 U2.12), 7_seg_display (R19.2)
B_ANODE_OUT: atmega328p (P3.6 U2.27), 7_seg_display (R20.2)
C_ANODE_OUT: atmega328p (P3.8 U2.14), 7_seg_display (R21.2)
D_ANODE_OUT: atmega328p (P3.1 U2.4), 7_seg_display (R22.2)
DA_OUT: atmega328p (P3.7 U2.13), 7_seg_display (R26.2)
DOWNSHIFT: atmega328p (U2.24), shifting_buttons (P11.1 R10.1)
E_ANODE_OUT: atmega328p (P3.2 U2.5), 7_seg_display (R23.2)
F_ANODE_OUT: atmega328p (P3.4 U2.11), 7_seg_display (R24.2)
G_ANODE_OUT: atmega328p (P3.3 U2.6), 7_seg_display (R25.2)
MISO: atmega328p (14 pins), MCP2515 (U3.13 U3.14 U3.15)
NEOPIXELS_OUT: atmega328p (U2.15), shiftLights (R18.2)
NetENC1_A: atmega328p (U2.26), rotaryEncoder (ENC1.A R11.2)
NetENC1_B: atmega328p (U2.25), rotaryEncoder (ENC1.B R12.2)
NetP12_1: atmega328p (U2.28), startStop (P12.1 R17.1)
NetU3_1: MCP2515 (U3.1), MCP2551 (U4.1)
NetU3_2: MCP2515 (U3.2), MCP2551 (U4.4)
SPI_CS_n: atmega328p (P7.1 U2.16), MCP2515 (U3.16)
UPSHIFT: atmega328p (U2.23), shifting_buttons (P10.1 R9.1)